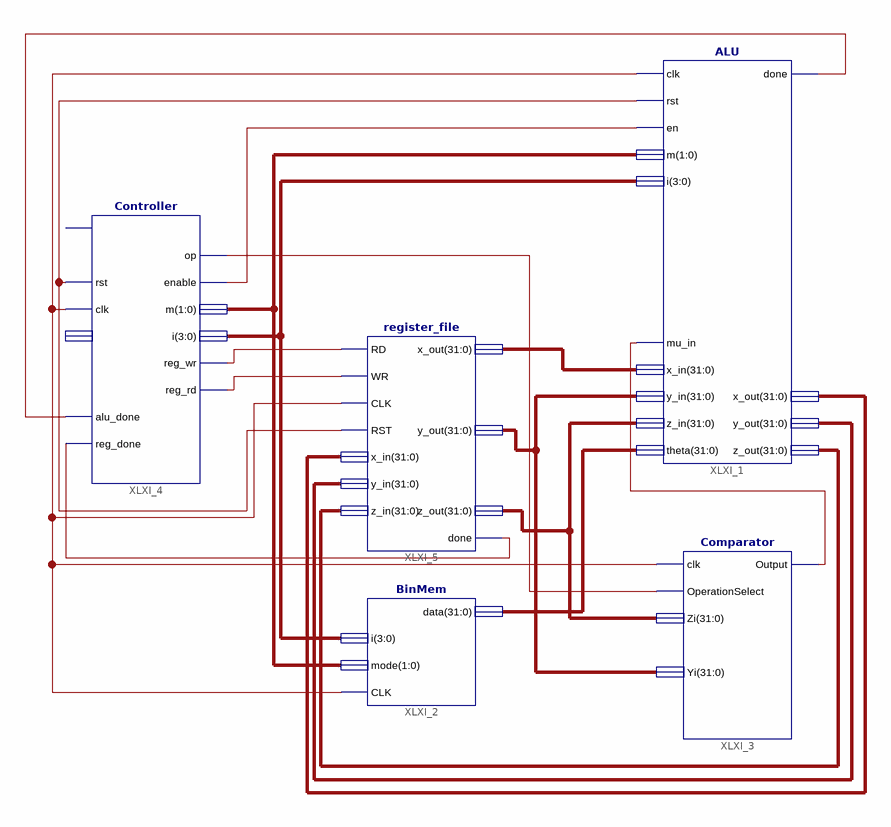
[diagram p0: schematic sheet 1]
// Xilinx ISE schematic SystemSchematic.sch (spartan3e) as structural Verilog: 5 symbols, 0 ports
module SystemSchematic (
);

  wire XLXN_1, XLXN_15, XLXN_16, XLXN_34, XLXN_37, XLXN_38, XLXN_41, XLXN_67, XLXN_68;
  wire [1:0] XLXN_26;
  wire [3:0] XLXN_25;
  wire [31:0] XLXN_2, XLXN_9, XLXN_12, XLXN_55, XLXN_56, XLXN_57, XLXN_58;

  ALU XLXI_1 (
    .rst(XLXN_38), .clk(XLXN_37), .en(XLXN_41), .mu_in(XLXN_1), .i(XLXN_25), .m(XLXN_26), .x_in(XLXN_2),
    .y_in(XLXN_58), .z_in(XLXN_57), .theta(XLXN_9), .done(XLXN_67), .x_out(XLXN_12), .y_out(XLXN_55),
    .z_out(XLXN_56));
  BinMem XLXI_2 (.i(XLXN_25), .mode(XLXN_26), .data(XLXN_9), .CLK(XLXN_37));
  Comparator XLXI_3 (.clk(XLXN_37), .OperationSelect(XLXN_34), .Zi(XLXN_57), .Yi(XLXN_58), .Output(XLXN_1));
  Controller XLXI_4 (
    .rst(XLXN_38), .clk(XLXN_37), .enable(XLXN_41), .reg_wr(XLXN_15), .reg_rd(XLXN_16), .op(XLXN_34),
    .m(XLXN_26), .i(XLXN_25), .alu_done(XLXN_67), .reg_done(XLXN_68));  // open: start, code
  register_file XLXI_5 (
    .RD(XLXN_15), .WR(XLXN_16), .CLK(XLXN_37), .RST(XLXN_38), .x_in(XLXN_12), .y_in(XLXN_55), .z_in(XLXN_56),
    .x_out(XLXN_2), .y_out(XLXN_58), .z_out(XLXN_57), .done(XLXN_68));
endmodule
